# EAGLE schematic 4brar07_Buck_Boost_Module_With_Led_Matrix (EAGLE 9.6.2)
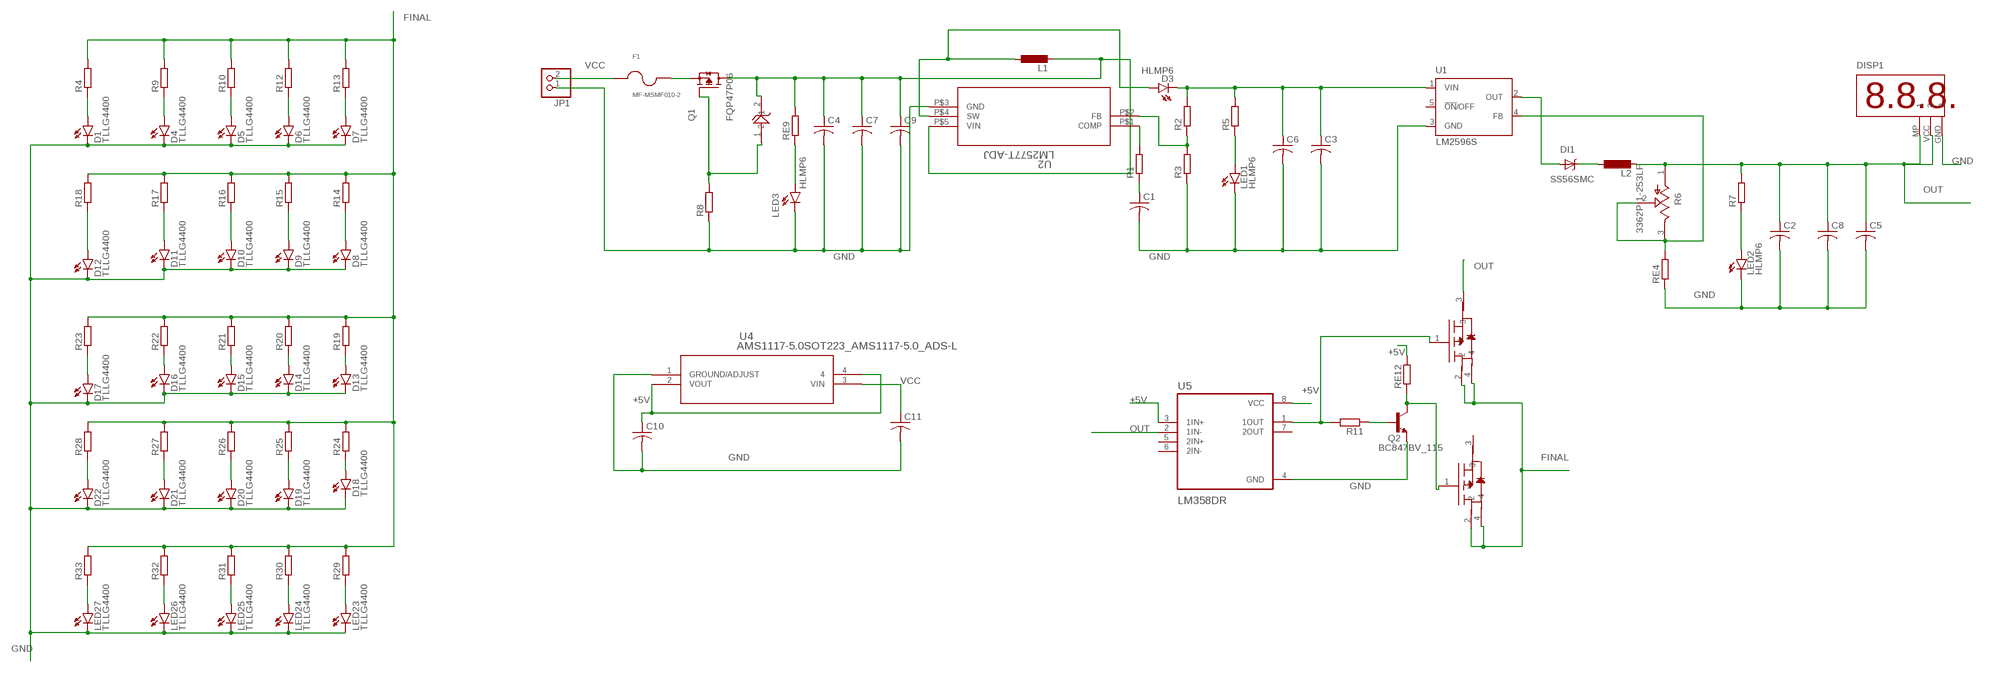
[diagram p0: schematic, sheet 1]

## Parts
C1  C-USC0805  [C0805]
C2  C-USC0805  [C0805]
C3  C-USC0805  [C0805]
C4  C-USC0805  [C0805]
C5  C-USC0805  [C0805]
C6  C-USC0805  [C0805]
C7  C-USC0805  [C0805]
C8  C-USC0805  [C0805]
C9  C-USC0805  [C0805]
C10  C-USC0805  [C0805]
C11  C-USC0805  [C0805]
D1  TLLG4400  [LED3MM]
D3  HLMP6  [HLMP6]
D4  TLLG4400  [LED3MM]
D5  TLLG4400  [LED3MM]
D6  TLLG4400  [LED3MM]
D7  TLLG4400  [LED3MM]
D8  TLLG4400  [LED3MM]
D9  TLLG4400  [LED3MM]
D10  TLLG4400  [LED3MM]
D11  TLLG4400  [LED3MM]
D12  TLLG4400  [LED3MM]
D13  TLLG4400  [LED3MM]
D14  TLLG4400  [LED3MM]
D15  TLLG4400  [LED3MM]
D16  TLLG4400  [LED3MM]
D17  TLLG4400  [LED3MM]
D18  TLLG4400  [LED3MM]
D19  TLLG4400  [LED3MM]
D20  TLLG4400  [LED3MM]
D21  TLLG4400  [LED3MM]
D22  TLLG4400  [LED3MM]
DI1  SS56SMC  [SMC]
DISP1  VOLTMETER  [VOLTMETER]
F1  MF-MSMF010-2  [FUSER_MF-MSMF010-2]
JP1  PINHD-1X2  [1X02]
L1  L-EUL1812  [L1812]
L2  L-EUL1812  [L1812]
LED1  HLMP6  [HLMP6]
LED2  HLMP6  [HLMP6]
LED3  HLMP6  [HLMP6]
LED23  TLLG4400  [LED3MM]
LED24  TLLG4400  [LED3MM]
LED25  TLLG4400  [LED3MM]
LED26  TLLG4400  [LED3MM]
LED27  TLLG4400  [LED3MM]
Q1  FQP47P06  [TO254P1067X483X2286-3]
Q2  BC847BV_115  [SOT666]
Q3  NTF5P03T3G  [SOT230P700X175-4N]
Q4  NTF5P03T3G  [SOT230P700X175-4N]
R1  R-EU_R0805  [R0805]
R2  R-EU_R0805  [R0805]
R3  R-EU_R0805  [R0805]
R4  R-EU_R0805  [R0805]
R5  R-EU_R0805  [R0805]
R6  3362P-1-253LF  [TRIM_3362P-1-253LF]
R7  R-EU_R0805  [R0805]
R8  R-EU_R0805  [R0805]
R9  R-EU_R0805  [R0805]
R10  R-EU_R0805  [R0805]
R11  R-EU_R0805  [R0805]
R12  R-EU_R0805  [R0805]
R13  R-EU_R0805  [R0805]
R14  R-EU_R0805  [R0805]
R15  R-EU_R0805  [R0805]
R16  R-EU_R0805  [R0805]
R17  R-EU_R0805  [R0805]
R18  R-EU_R0805  [R0805]
R19  R-EU_R0805  [R0805]
R20  R-EU_R0805  [R0805]
R21  R-EU_R0805  [R0805]
R22  R-EU_R0805  [R0805]
R23  R-EU_R0805  [R0805]
R24  R-EU_R0805  [R0805]
R25  R-EU_R0805  [R0805]
R26  R-EU_R0805  [R0805]
R27  R-EU_R0805  [R0805]
R28  R-EU_R0805  [R0805]
R29  R-EU_R0805  [R0805]
R30  R-EU_R0805  [R0805]
R31  R-EU_R0805  [R0805]
R32  R-EU_R0805  [R0805]
R33  R-EU_R0805  [R0805]
RE4  R-EU_R0805  [R0805]
RE9  R-EU_R0805  [R0805]
RE12  R-EU_R0805  [R0805]
U1  LM2596S  [TO263-5]
U2  LM2577T-ADJ  [VREG_LM2577T-ADJ/NOPB]
U4  AMS1117-5.0SOT223_AMS1117-5.0_ADS-L  [SOT223_AMS1117-5.0_ADS-L]
U5  LM358DR  [SOIC127P599X175-8N]
U$1  ZMM12  [ZMM12]

## Nets
4: D3.A L1.1 U2.P$4(SW)
+5V [Power]: C10.1 RE12.2 U4.2(VOUT) U4.4 U5.3(1IN+) U5.8(VCC)
FINAL [Power]: Q3.2 Q3.4 Q4.2 Q4.4 R4.2 R9.2 R10.2 R12.2 R13.2 R14.2 R15.2 R16.2 R17.2 R18.2 R19.2 R20.2 R21.2 R22.2 R23.2 R24.2 R25.2 R26.2 R27.2 R28.2 R29.2 R30.2 R31.2 R32.2 R33.2
GND [Power]: C1.2 C2.2 C3.2 C4.2 C5.2 C6.2 C7.2 C8.2 C9.2 C10.2 C11.2 D1.K(C) D4.K(C) D5.K(C) D6.K(C) D7.K(C) D8.K(C) D9.K(C) D10.K(C) D11.K(C) D12.K(C) D13.K(C) D14.K(C) D15.K(C) D16.K(C) D17.K(C) D18.K(C) D19.K(C) D20.K(C) D21.K(C) D22.K(C) DISP1.GND JP1.1 LED1.K LED2.K LED3.K LED23.K(C) LED24.K(C) LED25.K(C) LED26.K(C) LED27.K(C) Q2.5 R3.1 R8.1 RE4.1 U1.3(GND) U2.P$3(GND) U4.1(GROUND/ADJUST) U5.4(GND)
N$1: D1.A R4.1
N$2: F1.2 Q1.3(S)
N$3: C4.1 C7.1 C9.1 L1.2 Q1.2(D) RE9.2 U2.P$5(VIN) U$1.2
N$4: Q1.1(G) R8.2 U$1.1
N$5: D4.A R9.1
N$6: LED3.A RE9.1
N$7: C3.1 C6.1 D3.K R2.2 R5.2 U1.1(VIN)
N$8: C1.1 R1.1
N$9: R1.2 U2.P$1(COMP)
N$11: D5.A R10.1
N$12: D22.A R28.1
N$13: LED1.A R5.1
N$14: D21.A R27.1
N$15: Q2.1 R11.1
N$16: D20.A R26.1
N$17: Q2.3 Q4.1 RE12.1
N$18: DI1.A U1.2(OUT)
N$19: DI1.C L2.1
N$20: D19.A R25.1
N$21: R6.2(WIPER) R6.3(CW) RE4.2 U1.4(FB)
N$22: LED2.A R7.1
N$23: D18.A R24.1
N$24: Q3.1 R11.2 U5.1(1OUT)
N$25: D6.A R12.1
N$26: LED23.A R29.1
N$27: LED24.A R30.1
N$28: LED25.A R31.1
N$29: LED26.A R32.1
N$30: LED27.A R33.1
N$31: D17.A R23.1
N$32: D16.A R22.1
N$33: D15.A R21.1
N$34: D14.A R20.1
N$35: D13.A R19.1
N$36: D7.A R13.1
N$38: D12.A R18.1
N$39: D11.A R17.1
N$40: D10.A R16.1
N$41: D9.A R15.1
N$42: D8.A R14.1
N$43: R2.1 R3.2 U2.P$2(FB)
OUT: C2.1 C5.1 C8.1 DISP1.MP DISP1.VCC L2.2 Q3.3 R6.1(CCW) R7.2 U5.2(1IN-)
VCC [Power]: C11.1 F1.1 JP1.2 U4.3(VIN)
Unconnected: Q4.3 U1.5(!ON!/OFF) U5.5(2IN+) U5.6(2IN-) U5.7(2OUT)

## Library data of the parts
C1-C11 = rcl:C-US: CAPACITOR, American symbol; SPICEPREFIX: C
D1 D4-D22 LED23-LED27 = led:TLLG4400: Low Current (2mA) LED 3 mm Tinted Diffused Package color GREEN Source: Data sheet <http://www.farnell.com/datasheets/391098.pdf>; MF: VISHAY SEMICONDUCTOR; OC_FARNELL: 1612435
D3 LED1-LED3 = display-hp:HLMP6: LED 2mm horizontal; MF: AGILENT TECHNOLOGIES; MPN: HLMP-6500; OC_FARNELL: 1652490; OC_NEWARK: 40K0088
DI1 = SS56:SS56: Check availability <https://pricing.snapeda.com/parts/SS56/MDD/view-part?ref=eda>; AVAILABILITY: In Stock; CHECK_PRICES: https://www.snapeda.com/parts/SS56/MDD/view-part/?ref=eda; DESCRIPTION: Diode Schottky 60 V 5A Surface Mount SMA; MF: MDD; MP: SS56; PACKAGE: None; PRICE: None; SNAPEDA_LINK: https://www.snapeda.com/parts/SS56/MDD/view-part/?ref=snap
DISP1 = voltmeter:VOLTMETER; DISP1: DISP1
F1 = MF-MSMF010-2:MF-MSMF010-2: Check availability <https://pricing.snapeda.com/parts/MF-MSMF010-2/Bourns/view-part?ref=eda>; AVAILABILITY: In Stock; CHECK_PRICES: https://www.snapeda.com/parts/MF-MSMF010-2/Bourns/view-part/?ref=eda; DESCRIPTION: Fuse Resettable 40A Sz 4532 0.186x0.134x0.043 SMT 60VDC DCR 0.7 Ohms PCB | Bourns MF-MSMF010-2; MF: Bourns; MP: MF-MSMF010-2; PACKAGE: 1812 Bourns; PRICE: None; SNAPEDA_LINK: https://www.snapeda.com/parts/MF-MSMF010-2/Bourns/view-part/?ref=snap
JP1 = pinhead:PINHD-1X2: PIN HEADER
L1 L2 = rcl:L-EU: INDUCTOR, European symbol; SPICEPREFIX: L
Q1 = FQP47P06:FQP47P06: Check availability <https://pricing.snapeda.com/parts/FQP47P06/ON%20Semiconductor/view-part?ref=eda>; AVAILABILITY: In Stock; CHECK_PRICES: https://www.snapeda.com/parts/FQP47P06/Onsemi/view-part/?ref=eda; DESCRIPTION: P-Channel 60 V 47A (Tc) 160W (Tc) Through Hole TO-220-3; MF: ON Semiconductor; MP: FQP47P06; PACKAGE: TO-220-3 ON; PRICE: None; SNAPEDA_LINK: https://www.snapeda.com/parts/FQP47P06/Onsemi/view-part/?ref=snap
Q2 = BC847BV_115:BC847BV_115
Q3 Q4 = NTF5P03T3G:NTF5P03T3G
R1-R5 R7-R33 RE4 RE9 RE12 = rcl:R-EU_: RESISTOR, European symbol; SPICEPREFIX: R
R6 = 3362P-1-253LF:3362P-1-253LF: Check availability <https://pricing.snapeda.com/parts/3362P-1-253LF/Bourns/view-part?ref=eda>; AVAILABILITY: In Stock; CHECK_PRICES: https://www.snapeda.com/parts/3362P-1-253LF/Bourns/view-part/?ref=eda; DESCRIPTION: 1/4 Sq, Thru-Hole, TRIMMER, 25 Kilohms, Cermet, Single Turn | Bourns 3362P-1-253LF; MF: Bourns; MP: 3362P-1-253LF; PACKAGE: 3362P-1 Bourns Inc.; PRICE: None; SNAPEDA_LINK: https://www.snapeda.com/parts/3362P-1-253LF/Bourns/view-part/?ref=snap
U1 = national-semiconductor:LM2596: SIMPLE SWITCHER® Power Converter 150 kHz 3A Step-Down Voltage Regulator Source: http://www.national.com/ds/LM/LM2596.pdf; MF: NATIONAL SEMICONDUCTOR; MPN: LM2596S-ADJ/NOPB; OC_FARNELL: 9494367; OC_NEWARK: 41K3842
U2 = LM2577T-ADJ_NOPB:LM2577T-ADJ
U4 = AMS1117-5.0:AMS1117-5.0; COPYRIGHT: Copyright (C) 2025 Ultra Librarian. All rights reserved.; MANUFACTURER_NAME: Advanced Monolithic Systems; MANUFACTURER_PART_NUMBER: AMS1117-5.0
U5 = LM358DR:LM358DR: Check availability <https://pricing.snapeda.com/parts/LM358DR/Rohm%20Semiconductor/view-part?ref=eda>; AVAILABILITY: In Stock; CHECK_PRICES: https://www.snapeda.com/parts/LM358DR/Rohm/view-part/?ref=eda; DESCRIPTION: Standard (General Purpose) Amplifier 2 Circuit 8-SOIC; MF: Rohm Semiconductor; MP: LM358DR; PACKAGE: None; PRICE: None; SNAPEDA_LINK: https://www.snapeda.com/parts/LM358DR/Rohm/view-part/?ref=snap
U$1 = ZMM12:ZMM12

## Net classes
0 default: width 0.25 mm, drill 0.3 mm, clearance 0.3 mm
1 Power: width 0.5 mm, drill 0.3 mm, clearance 0.3 mm